# Altium schematic sheet Push Button 4P.schdoc
size 127 x 101 mm
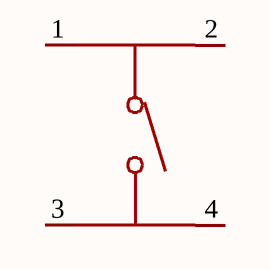
[diagram p0: Push Button 4P.schdoc]

## Parts
SW?  TS-1102-5516  [SW-TH_4P-L6.0-W6.0-P3.90-LS6.5]  (value not drawn)

## Nets

Not connected (* = marked no-connect by the designer): SW? 1 2 3 4

## Library data of the parts
SW? = TS-1102-5516: Manufacturer: SOFNG(硕方); Add into BOM: yes; Circuit: SPST; Actuator Style: Round Button; Operating Force: 1.6N; Switch Length: 6mm; Switch Height: 5.5mm; Contact Current: 25mA; Voltage Rating (DC): 24V; Actuator/Cap Color: Black; Mechanical Life: 100000次; Symbol: TS-1102-5516; Device: TS-1102-5516; LCSC Part Name: 6*6*5.5mm 直插 轻触开关; Supplier Part: C183624; Manufacturer Part: TS-1102-5516; Supplier Footprint: 插件; JLCPCB Part Class: Extended Part; Datasheet: https://atta.szlcsc.com/upload/public/pdf/source/20200911/C111374_C70AFD1A656F1EADE52E4A6E5D3FC819.pdf; Supplier: LCSC; Convert to PCB: yes; Mounting Style: Straight; Switch Width: 6mm; With Lamp: -; Operating Temperature: -40℃~+85℃